# Altium schematic sheet Current_AC.SchDoc: Current AC sense
size A3; Organization: ORGANIZATION; Address1: ADDRESS 1; Address2: ADDRESS 2; Address3: ADDRESS 3; Address4: ADDRESS 4; Revision: 0.0; SheetNumber: 11; SheetTotal: 19; ENG_APP_DATE: --/--/--; DSN_APP_DATE: --/--/--; CHK_APP_DATE: --/--/--
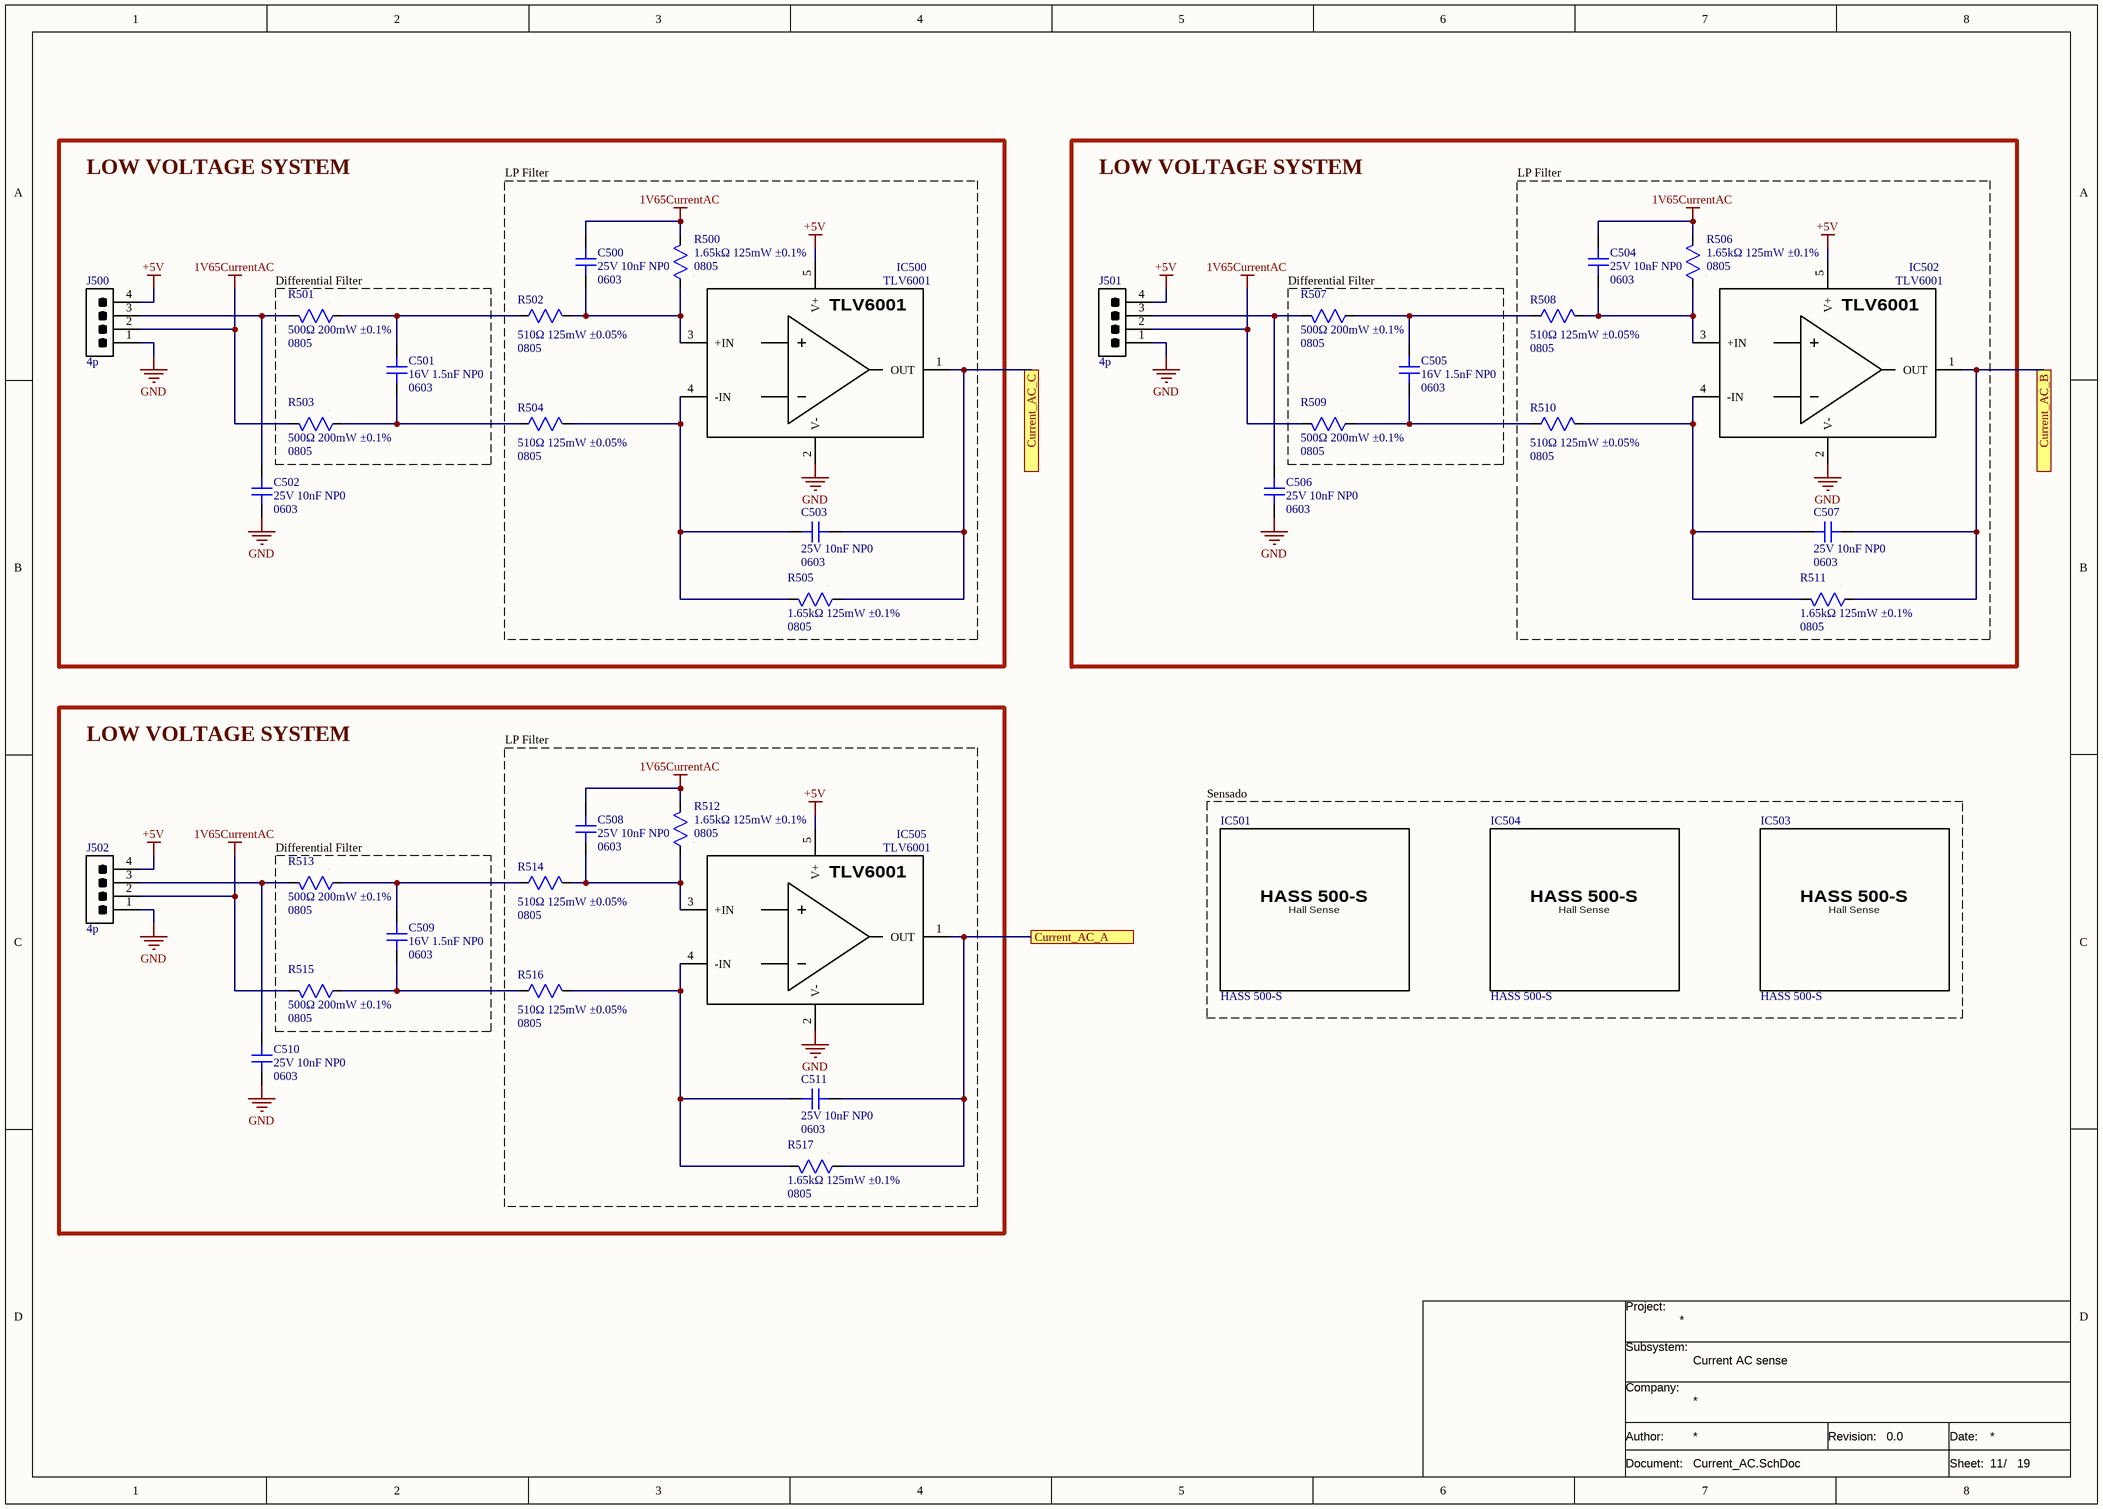
[diagram p0: Current_AC.SchDoc]

## Parts
C500  value 25V 10nF NP0  Package: 0603  [CAP SMD 0603]  (hidden comment: CAP non polarized)
C501  value 16V 1.5nF NP0  Package: 0603  [CAP SMD 0603]  (hidden comment: CAP non polarized)
C502  value 25V 10nF NP0  Package: 0603  [CAP SMD 0603]  (hidden comment: CAP non polarized)
C503  value 25V 10nF NP0  Package: 0603  [CAP SMD 0603]  (hidden comment: CAP non polarized)
C504  value 25V 10nF NP0  Package: 0603  [CAP SMD 0603]  (hidden comment: CAP non polarized)
C505  value 16V 1.5nF NP0  Package: 0603  [CAP SMD 0603]  (hidden comment: CAP non polarized)
C506  value 25V 10nF NP0  Package: 0603  [CAP SMD 0603]  (hidden comment: CAP non polarized)
C507  value 25V 10nF NP0  Package: 0603  [CAP SMD 0603]  (hidden comment: CAP non polarized)
C508  value 25V 10nF NP0  Package: 0603  [CAP SMD 0603]  (hidden comment: CAP non polarized)
C509  value 16V 1.5nF NP0  Package: 0603  [CAP SMD 0603]  (hidden comment: CAP non polarized)
C510  value 25V 10nF NP0  Package: 0603  [CAP SMD 0603]  (hidden comment: CAP non polarized)
C511  value 25V 10nF NP0  Package: 0603  [CAP SMD 0603]  (hidden comment: CAP non polarized)
IC500  TLV6001  [SOT-23-5]
IC501  HASS 500-S  [HASS 500-S]
IC502  TLV6001  [SOT-23-5]
IC503  HASS 500-S  [HASS 500-S]
IC504  HASS 500-S  [HASS 500-S]
IC505  TLV6001  [SOT-23-5]
J500  value 4p  [B4B-XH-A-BK(LF)(SN)]  (hidden comment: CONN 4P)
J501  value 4p  [B4B-XH-A-BK(LF)(SN)]  (hidden comment: CONN 4P)
J502  value 4p  [B4B-XH-A-BK(LF)(SN)]  (hidden comment: CONN 4P)
R500  value 1.65kΩ 125mW ±0.1%  Package: 0805  [RES SMD 0805]  (hidden comment: RES)
R501  value 500Ω 200mW ±0.1%  Package: 0805  [RES SMD 0805]  (hidden comment: RES)
R502  value 510Ω 125mW ±0.05%  Package: 0805  [RES SMD 0805]  (hidden comment: RES)
R503  value 500Ω 200mW ±0.1%  Package: 0805  [RES SMD 0805]  (hidden comment: RES)
R504  value 510Ω 125mW ±0.05%  Package: 0805  [RES SMD 0805]  (hidden comment: RES)
R505  value 1.65kΩ 125mW ±0.1%  Package: 0805  [RES SMD 0805]  (hidden comment: RES)
R506  value 1.65kΩ 125mW ±0.1%  Package: 0805  [RES SMD 0805]  (hidden comment: RES)
R507  value 500Ω 200mW ±0.1%  Package: 0805  [RES SMD 0805]  (hidden comment: RES)
R508  value 510Ω 125mW ±0.05%  Package: 0805  [RES SMD 0805]  (hidden comment: RES)
R509  value 500Ω 200mW ±0.1%  Package: 0805  [RES SMD 0805]  (hidden comment: RES)
R510  value 510Ω 125mW ±0.05%  Package: 0805  [RES SMD 0805]  (hidden comment: RES)
R511  value 1.65kΩ 125mW ±0.1%  Package: 0805  [RES SMD 0805]  (hidden comment: RES)
R512  value 1.65kΩ 125mW ±0.1%  Package: 0805  [RES SMD 0805]  (hidden comment: RES)
R513  value 500Ω 200mW ±0.1%  Package: 0805  [RES SMD 0805]  (hidden comment: RES)
R514  value 510Ω 125mW ±0.05%  Package: 0805  [RES SMD 0805]  (hidden comment: RES)
R515  value 500Ω 200mW ±0.1%  Package: 0805  [RES SMD 0805]  (hidden comment: RES)
R516  value 510Ω 125mW ±0.05%  Package: 0805  [RES SMD 0805]  (hidden comment: RES)
R517  value 1.65kΩ 125mW ±0.1%  Package: 0805  [RES SMD 0805]  (hidden comment: RES)

## Blocks framed on the sheet
LOW VOLTAGE SYSTEM: C502 J500
LOW VOLTAGE SYSTEM: C506 J501
LP Filter: C500 C503 IC500 R500 R502 R504 R505
LP Filter: C504 C507 IC502 R506 R508 R510 R511
Differential Filter: C501 R501 R503
Differential Filter: C505 R507 R509
LOW VOLTAGE SYSTEM: C510 J502
LP Filter: C508 C511 IC505 R512 R514 R516 R517
Sensado: IC501 IC503 IC504
Differential Filter: C509 R513 R515

## Ports
Current_AC_A, Current_AC_B, Current_AC_C

## Nets
1V65CurrentAC: C500.1 C504.1 C508.1 J500.2 J501.2 J502.2 R500.2 R503.2 R506.2 R509.2 R512.2 R515.2
+5V: IC500.5(V+) IC502.5(V+) IC505.5(V+) J500.4 J501.4 J502.4
GND: C502.2 C506.2 C510.2 IC500.2(V-) IC502.2(V-) IC505.2(V-) J500.1 J501.1 J502.1
Current_AC_A: C511.2 IC505.1(OUT) R517.1 ; port Current_AC_A
Current_AC_B: C507.2 IC502.1(OUT) R511.1 ; port Current_AC_B
Current_AC_C: C503.2 IC500.1(OUT) R505.1 ; port Current_AC_C
NetC500_2: C500.2 IC500.3(+IN) R500.1 R502.2
NetC501_1: C501.1 R501.1 R502.1
NetC501_2: C501.2 R503.1 R504.1
NetC502_1: C502.1 J500.3 R501.2
NetC503_1: C503.1 IC500.4(-IN) R504.2 R505.2
NetC504_2: C504.2 IC502.3(+IN) R506.1 R508.2
NetC505_1: C505.1 R507.1 R508.1
NetC505_2: C505.2 R509.1 R510.1
NetC506_1: C506.1 J501.3 R507.2
NetC507_1: C507.1 IC502.4(-IN) R510.2 R511.2
NetC508_2: C508.2 IC505.3(+IN) R512.1 R514.2
NetC509_1: C509.1 R513.1 R514.1
NetC509_2: C509.2 R515.1 R516.1
NetC510_1: C510.1 J502.3 R513.2
NetC511_1: C511.1 IC505.4(-IN) R516.2 R517.2

## Notes on the sheet
- Project:
- Subsystem:
- Company:
- Document:
- Author:
- Revision:
- Date:
- Sheet:
- /
- (in symbol 060-0003) Hall Sense

## Library data of the parts
C500 C502-C504 C506-C508 C510 C511 = 001-0107: Condensadores de cerámica multicapa (MLCC- SMD/SMT) 0.01 uF 25 VDC 1% 0603 C0G (NP0) AEC-Q200; MPN: GRT1885C1E103FA02D; Manufacturer: muRata; ComponentLink1Description: Datasheet; ComponentLink1URL: https://www.mouser.es/datasheet/3/76/2/GRT1885C1E103FA02_01A.pdf; ComponentLink2Description: Distributor Link; ComponentLink2URL: https://www.mouser.es/ProductDetail/Murata-Electronics/GRT1885C1E103FA02D?qs=xZ%2FP%252Ba9zWqaqiXqJj78%252Bmg%3D%3D; ID: 001-0107; Distributor PN: 81-GRT1885C1E103FA2D; Distributor: Mouser
C501 C505 C509 = 001-0121: Condensadores de cerámica multicapa (MLCC- SMD/SMT) 25V 1500pF C0G 0603 1%; MPN: C0603C152F3GECTU; Manufacturer: KEMET; ComponentLink1Description: Datasheet; ComponentLink1URL: https://www.mouser.es/datasheet/3/508/1/KEM_C1091_C0G_ESD.pdf; ComponentLink2Description: Distributor Link; ComponentLink2URL: https://www.mouser.es/ProductDetail/KEMET/C0603C152F3GECTU?qs=Mv7BduZupUh%252Bk5D8ZWarTg%3D%3D; ID: 001-0121; Distributor PN: 80-C0603C152F3GEC; Distributor: Mouser
IC500 IC502 IC505 = 062-0002: Amplificadores operacionales - Op Amps Single 5.5-V 1-MHz R RIO operational a A A 595-TLV6001UIDBVT; MPN: TLV6001UIDBVR; Manufacturer: Texas Instruments; ID: 062-0002; Value: -; Package: SOT-23-5; Distributor PN: 595-TLV6001UIDBVR; Distributor: Mouser; ComponentLink1URL: https://www.ti.com/lit/ds/symlink/tlv6001.pdf?ts=1781607824916&ref_url=https%253A%252F%252Fcz.mouser.com%252F; ComponentLink2URL: https://www.mouser.es/ProductDetail/Texas-Instruments/TLV6001UIDBVR?qs=8N88piwwHEgntIgM8jjJ5Q%3D%3D
IC501 IC503 IC504 = 060-0003: Sensores de corriente montados en placa; Manufacturer: LEM; Value: 500A; ComponentLink1Description: Datasheet; ComponentLink1URL: https://www.lem.com/sites/default/files/products_datasheets/hass-50_600-s-v22.pdf; ComponentLink2Description: Distributor Link; ComponentLink2URL: https://www.mouser.es/ProductDetail/LEM/HASS-500-S?qs=Vi0JKjFBtYkICNHwIPcpdw%3D%3D; ID: 060-0003; Package: -; MPN: HASS 500-S; Distributor PN: 61-HASS500-S; Distributor: Mouser
J500-J502 = 110-0068: Alojamientos de cables y cabecera XH HEADER (TOP); Manufacturer: JST; ComponentLink1Description: Datasheet; ComponentLink1URL: https://www.mouser.es/datasheet/3/1070/1/eXH.pdf; ComponentLink2Description: Distributor Link; ComponentLink2URL: https://www.mouser.es/ProductDetail/JST-Commercial/B4B-XH-A-BKLFSN?qs=cIziFXvMxOXLG2L7xSRqLw%3D%3D; ID: 110-0068; Package: THT 2,5mm; MPN: B4B-XH-A-BK(LF)(SN); Distributor PN: 306-B4BXHABKLFSN; Distributor: Mouser
R500 R505 R506 R511 R512 R517 = 010-0153: Thin Film Resistors MCU 0805-15 0.1% P1 1K65; MPN: MCU08050E1651BP100; Manufacturer: Vishay; ComponentLink1Description: Datasheet; ComponentLink1URL: https://www.vishay.com/docs/28700/mcx0x0xpre.pdf; ComponentLink2Description: Distributor Link; ComponentLink2URL: https://www.mouser.es/ProductDetail/Vishay-Beyschlag/MCU08050E1651BP100?qs=sGAEpiMZZMvdGkrng054t2c0lhweLxbk6HRvs42FTBI%3D; ID: 010-0153; Distributor PN: 594-MCU08050E1651BP1; Distributor: Mouser
R501 R503 R507 R509 R513 R515 = 010-0178: Resistores de película fina - SMD 0.2W 500ohm 0.1% 10ppm; MPN: PTN0805Y5000BST1; Manufacturer: Vishay; ComponentLink1Description: Datasheet; ComponentLink1URL: https://www.vishay.com/docs/60026/ptn.pdf; ComponentLink2Description: Distributor Link; ComponentLink2URL: https://www.mouser.es/ProductDetail/Vishay-Thin-Film/PTN0805Y5000BST1?qs=zW32dvEIR3sKd%2FnwncGe3A%3D%3D; ID: 010-0178; Distributor PN: 71-PTN0805Y5000BST1; Distributor: Mouser
R502 R504 R508 R510 R514 R516 = 010-0179: Resistores de película fina - SMD 1/8W 510 Ohms 0.05% 0805 10ppm; MPN: RG2012N-511-W-T1; Manufacturer: Susumu; ComponentLink1Description: Datasheet; ComponentLink1URL: https://www.mouser.es/datasheet/3/826/1/n_catalog_partition01_en.pdf; ComponentLink2Description: Distributor Link; ComponentLink2URL: https://www.mouser.es/ProductDetail/Susumu/RG2012N-511-W-T1?qs=juJhw1yPxAFbuvw1oDA4sg%3D%3D; ID: 010-0179; Distributor PN: 754-RG2012N-511-W-T1; Distributor: Mouser